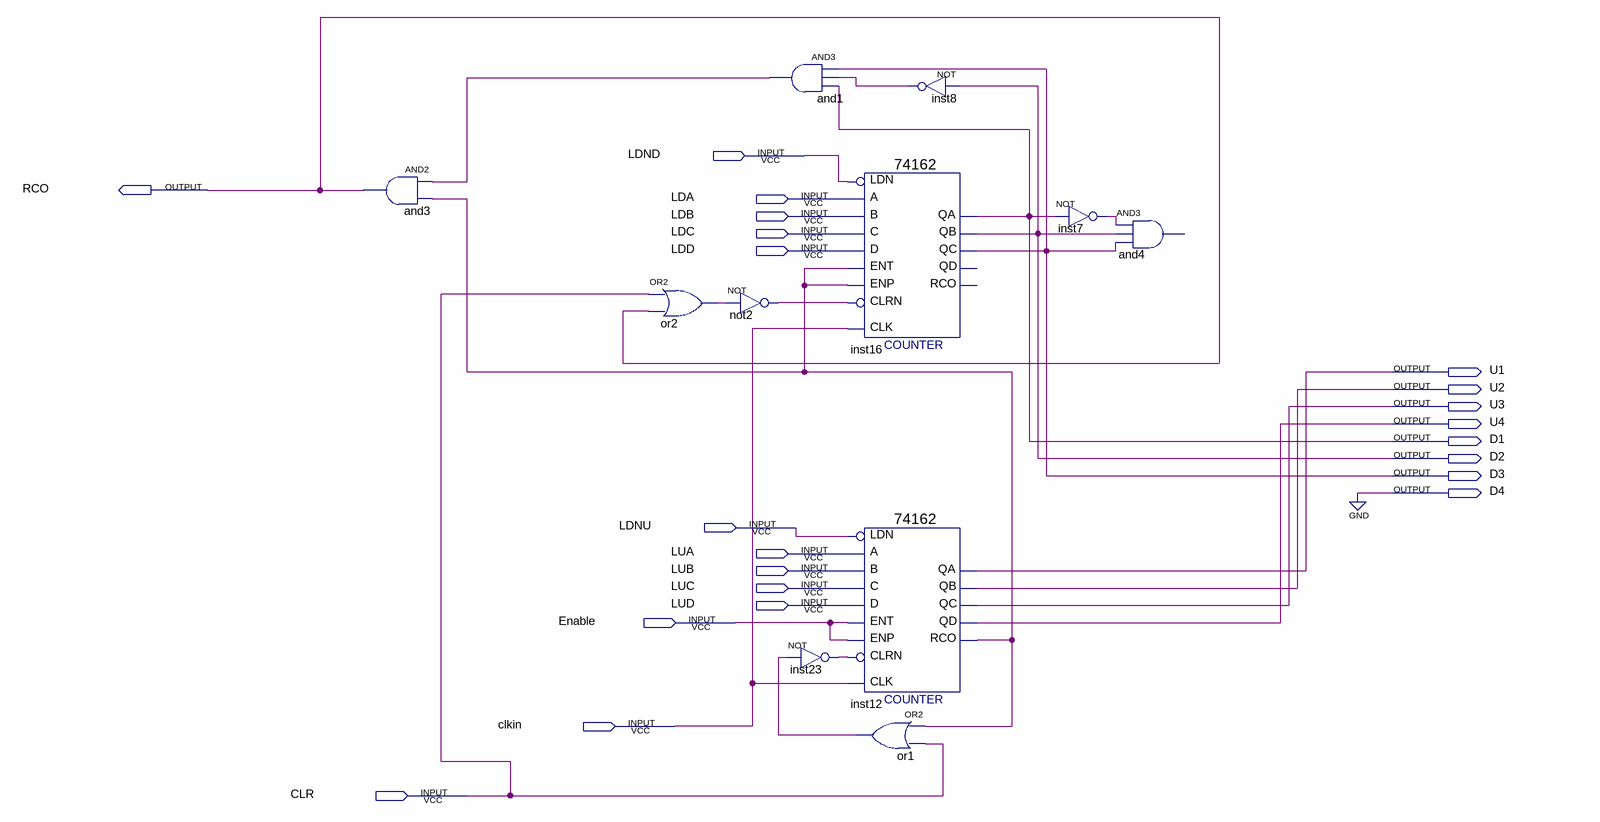
[diagram p0: schematic sheet]
// Quartus schematic Contador59.bdf as structural Verilog: 11 symbols, 22 pins
module Contador59 (
  input  LDND,
  input  LDA,
  input  LDB,
  input  LDC,
  input  LDD,
  input  LDNU,
  input  LUA,
  input  LUB,
  input  LUC,
  input  LUD,
  input  Enable,
  input  clkin,
  input  CLR,
  output RCO,
  output U1,
  output U2,
  output U3,
  output U4,
  output D1,
  output D2,
  output D3,
  output D4
);

  wire and1_out, inst7_out, inst8_out, inst12_rco, inst23_out, not2_out, or1_out, or2_out;

  and and3 (RCO, and1_out, inst12_rco);
  or or2 (or2_out, CLR, RCO);
  not not2 (not2_out, or2_out);
  and and1 (and1_out, D3, inst8_out, D1);
  not inst23 (inst23_out, or1_out);
  \74162  inst16 (
    .A(LDA), .LDN(LDND), .B(LDB), .C(LDC), .D(LDD), .ENP(inst12_rco), .ENT(inst12_rco), .CLRN(not2_out),
    .CLK(clkin), .QA(D1), .QB(D2), .QC(D3));  // open: QD, RCO
  \74162  inst12 (
    .A(LUA), .LDN(LDNU), .B(LUB), .C(LUC), .D(LUD), .ENP(Enable), .ENT(Enable), .CLRN(inst23_out),
    .CLK(clkin), .QA(U1), .QB(U2), .QC(U3), .QD(U4), .RCO(inst12_rco));
  or or1 (or1_out, inst12_rco, CLR);
  not inst8 (inst8_out, D2);
  not inst7 (inst7_out, D1);
  // AND3 and4 has open pins: IN1=inst7_out, IN2=D2, IN3=D3, OUT=open

  assign D4 = 1'b0;
endmodule
